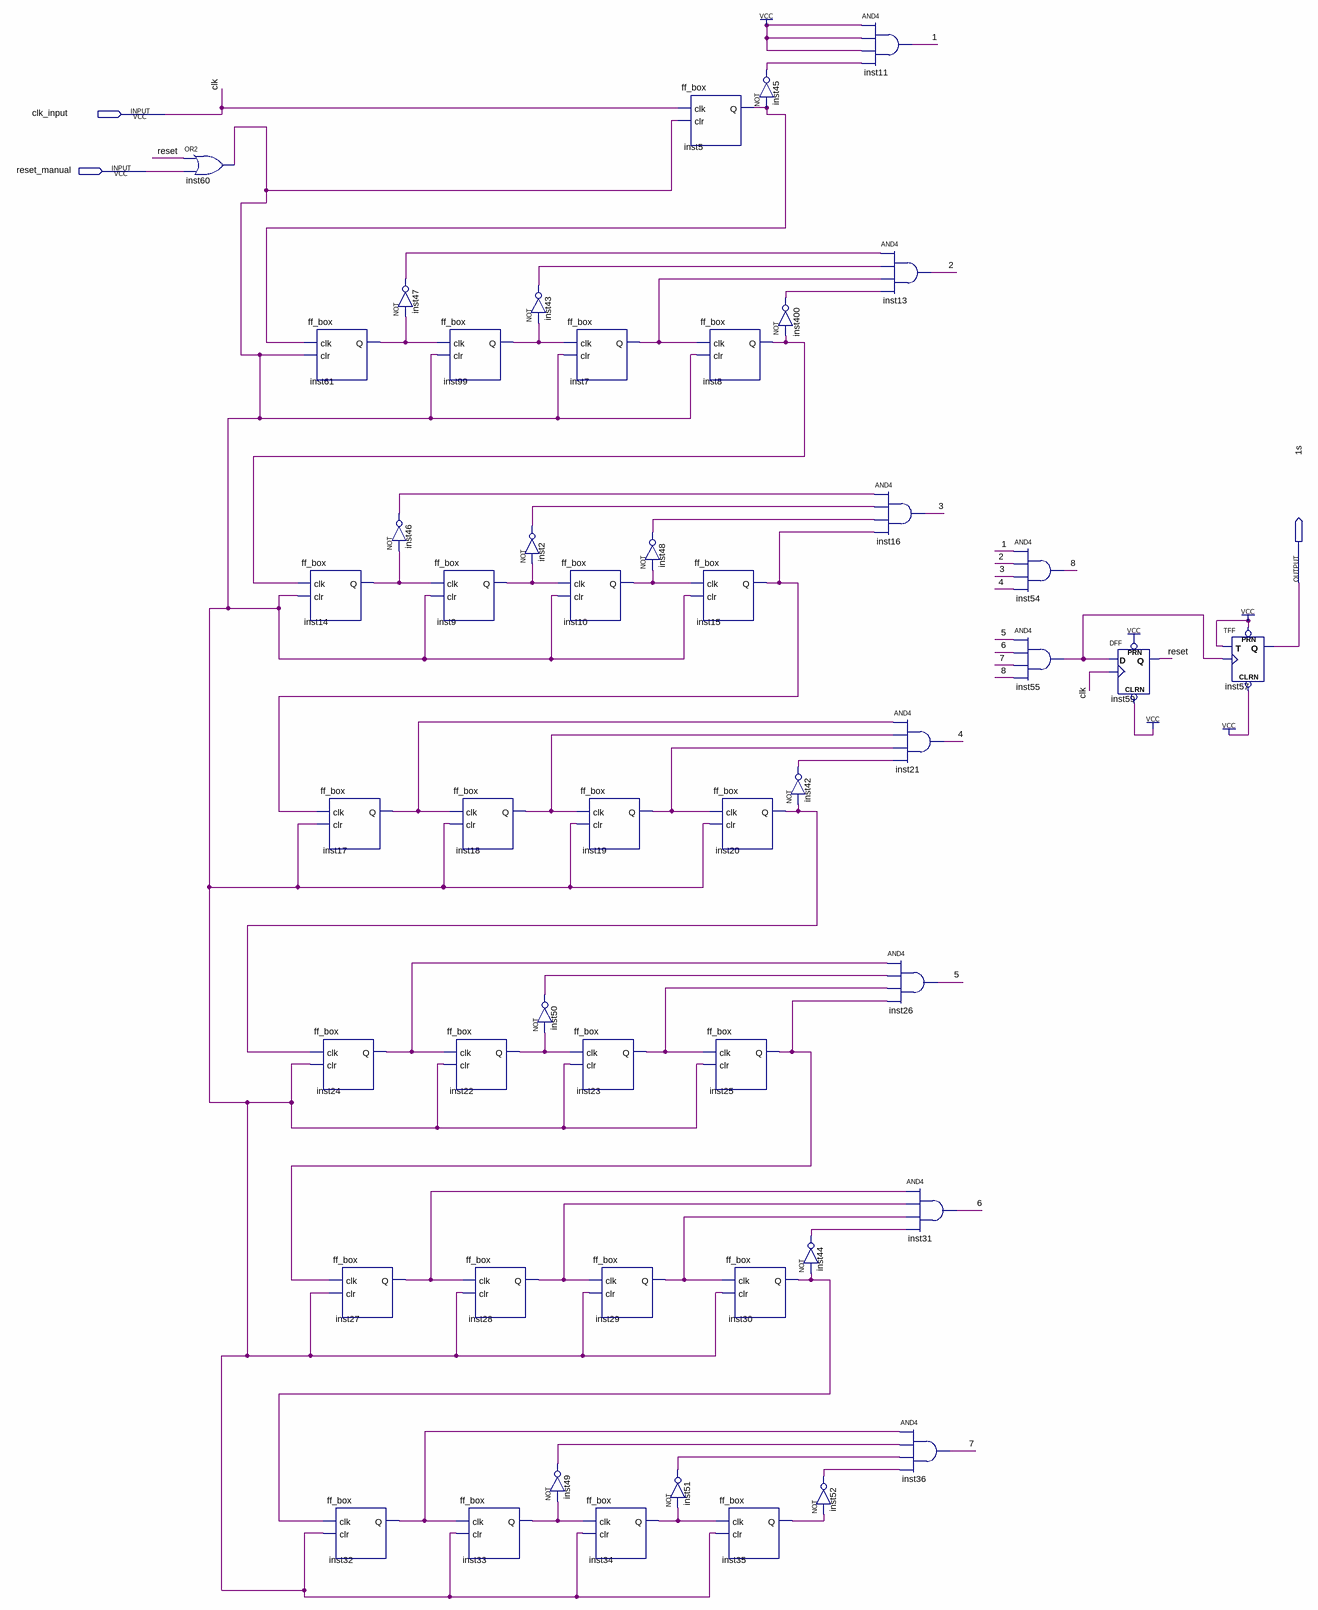
[diagram p0: schematic sheet]
// Quartus schematic freq_div.bdf as structural Verilog: 50 symbols, 3 pins
module freq_div (
  input  clk_input,
  input  reset_manual,
  output \1s 
);

  wire \1 , \2 , \3 , \4 , \5 , \6 , \7 , \8 , inst2_out, inst5_q, inst7_q, inst8_q, inst9_q, inst10_q,
       inst14_q, inst15_q, inst17_q, inst18_q, inst19_q, inst20_q, inst22_q, inst23_q, inst24_q, inst25_q,
       inst27_q, inst28_q, inst29_q, inst30_q, inst32_q, inst33_q, inst34_q, inst35_q, inst42_out,
       inst43_out, inst44_out, inst45_out, inst46_out, inst47_out, inst48_out, inst49_out, inst50_out,
       inst51_out, inst52_out, inst55_out, inst60_out, inst61_q, inst99_q, inst400_out, reset;

  or inst60 (inst60_out, reset, reset_manual);
  ff_box inst14 (.clk(inst8_q), .clr(inst60_out), .Q(inst14_q));
  ff_box inst61 (.clk(inst5_q), .clr(inst60_out), .Q(inst61_q));
  ff_box inst17 (.clk(inst15_q), .clr(inst60_out), .Q(inst17_q));
  ff_box inst24 (.clk(inst20_q), .clr(inst60_out), .Q(inst24_q));
  ff_box inst27 (.clk(inst25_q), .clr(inst60_out), .Q(inst27_q));
  ff_box inst32 (.clk(inst30_q), .clr(inst60_out), .Q(inst32_q));
  not inst47 (inst47_out, inst61_q);
  not inst46 (inst46_out, inst14_q);
  ff_box inst99 (.clk(inst61_q), .clr(inst60_out), .Q(inst99_q));
  ff_box inst9 (.clk(inst14_q), .clr(inst60_out), .Q(inst9_q));
  ff_box inst18 (.clk(inst17_q), .clr(inst60_out), .Q(inst18_q));
  ff_box inst22 (.clk(inst24_q), .clr(inst60_out), .Q(inst22_q));
  ff_box inst28 (.clk(inst27_q), .clr(inst60_out), .Q(inst28_q));
  ff_box inst33 (.clk(inst32_q), .clr(inst60_out), .Q(inst33_q));
  not inst43 (inst43_out, inst99_q);
  not inst2 (inst2_out, inst9_q);
  not inst50 (inst50_out, inst22_q);
  not inst49 (inst49_out, inst33_q);
  ff_box inst7 (.clk(inst99_q), .clr(inst60_out), .Q(inst7_q));
  ff_box inst10 (.clk(inst9_q), .clr(inst60_out), .Q(inst10_q));
  ff_box inst19 (.clk(inst18_q), .clr(inst60_out), .Q(inst19_q));
  ff_box inst23 (.clk(inst22_q), .clr(inst60_out), .Q(inst23_q));
  ff_box inst29 (.clk(inst28_q), .clr(inst60_out), .Q(inst29_q));
  ff_box inst34 (.clk(inst33_q), .clr(inst60_out), .Q(inst34_q));
  not inst48 (inst48_out, inst10_q);
  ff_box inst5 (.clk(clk_input), .clr(inst60_out), .Q(inst5_q));
  ff_box inst8 (.clk(inst7_q), .clr(inst60_out), .Q(inst8_q));
  ff_box inst15 (.clk(inst10_q), .clr(inst60_out), .Q(inst15_q));
  ff_box inst25 (.clk(inst23_q), .clr(inst60_out), .Q(inst25_q));
  not inst51 (inst51_out, inst34_q);
  not inst45 (inst45_out, inst5_q);
  ff_box inst20 (.clk(inst19_q), .clr(inst60_out), .Q(inst20_q));
  ff_box inst30 (.clk(inst29_q), .clr(inst60_out), .Q(inst30_q));
  ff_box inst35 (.clk(inst34_q), .clr(inst60_out), .Q(inst35_q));
  not inst400 (inst400_out, inst8_q);
  not inst42 (inst42_out, inst20_q);
  not inst44 (inst44_out, inst30_q);
  not inst52 (inst52_out, inst35_q);
  and inst11 (\1 , 1'b1, 1'b1, 1'b1, inst45_out);
  and inst13 (\2 , inst47_out, inst43_out, inst7_q, inst400_out);
  and inst16 (\3 , inst46_out, inst2_out, inst48_out, inst15_q);
  and inst21 (\4 , inst17_q, inst18_q, inst19_q, inst42_out);
  and inst26 (\5 , inst24_q, inst50_out, inst23_q, inst25_q);
  and inst31 (\6 , inst27_q, inst28_q, inst29_q, inst44_out);
  and inst36 (\7 , inst32_q, inst49_out, inst51_out, inst52_out);
  and inst54 (\8 , \1 , \2 , \3 , \4 );
  and inst55 (inst55_out, \5 , \6 , \7 , \8 );
  DFF inst59 (.CLRN(1'b1), .CLK(clk_input), .D(inst55_out), .PRN(1'b1), .Q(reset));
  TFF inst57 (.PRN(1'b1), .CLRN(1'b1), .T(1'b1), .CLK(inst55_out), .Q(\1s ));

  // Other names for the same wires on the sheet: clk = clk_input
endmodule
